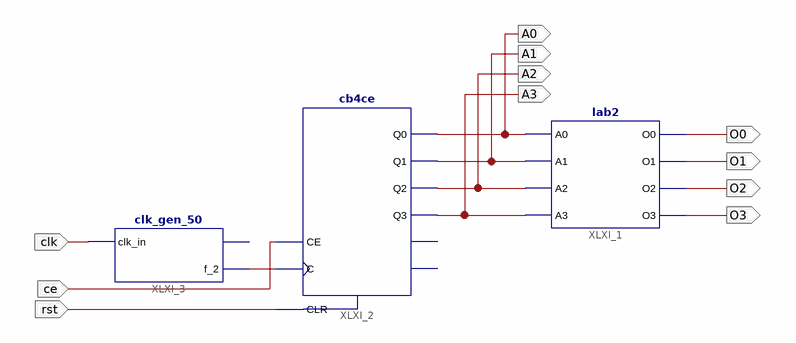
[diagram p0: schematic sheet 1]
// Xilinx ISE schematic B.sch (spartan3e) as structural Verilog: 3 symbols, 12 ports
module B (
  input  clk,
  input  XLXN_6,
  input  rst,
  input  ce,
  output A0,
  output A1,
  output A2,
  output A3,
  output O1,
  output O2,
  output O3,
  output O0
);

  wire XLXN_68;

  lab2 XLXI_1 (.A0(A0), .A1(A1), .A2(A2), .A3(A3), .O0(O0), .O1(O1), .O2(O2), .O3(O3));
  cb4ce XLXI_2 (.C(XLXN_68), .CE(ce), .CLR(rst), .Q0(A0), .Q1(A1), .Q2(A2), .Q3(A3));  // open: CEO, TC
  clk_gen_50 XLXI_3 (.clk_in(clk), .f_2(XLXN_68));  // open: f_1

  // Notes on the sheet:
  //   LOC on signal clk = B8
  //   LOC on signal rst = N17
  //   LOC on signal ce = R17
  //   LOC on signal A0 = L15
  //   LOC on signal A1 = K12
  //   LOC on signal A2 = L17
  //   LOC on signal A3 = M15
  //   LOC on signal O1 = L16
  //   LOC on signal O2 = M14
  //   LOC on signal O3 = M16
  //   LOC on signal O0 = K13
endmodule
